# EasyEDA Pro project ProDoc_Crumb_V1_2026-06-22.epro

# Schematic Crumb_V1
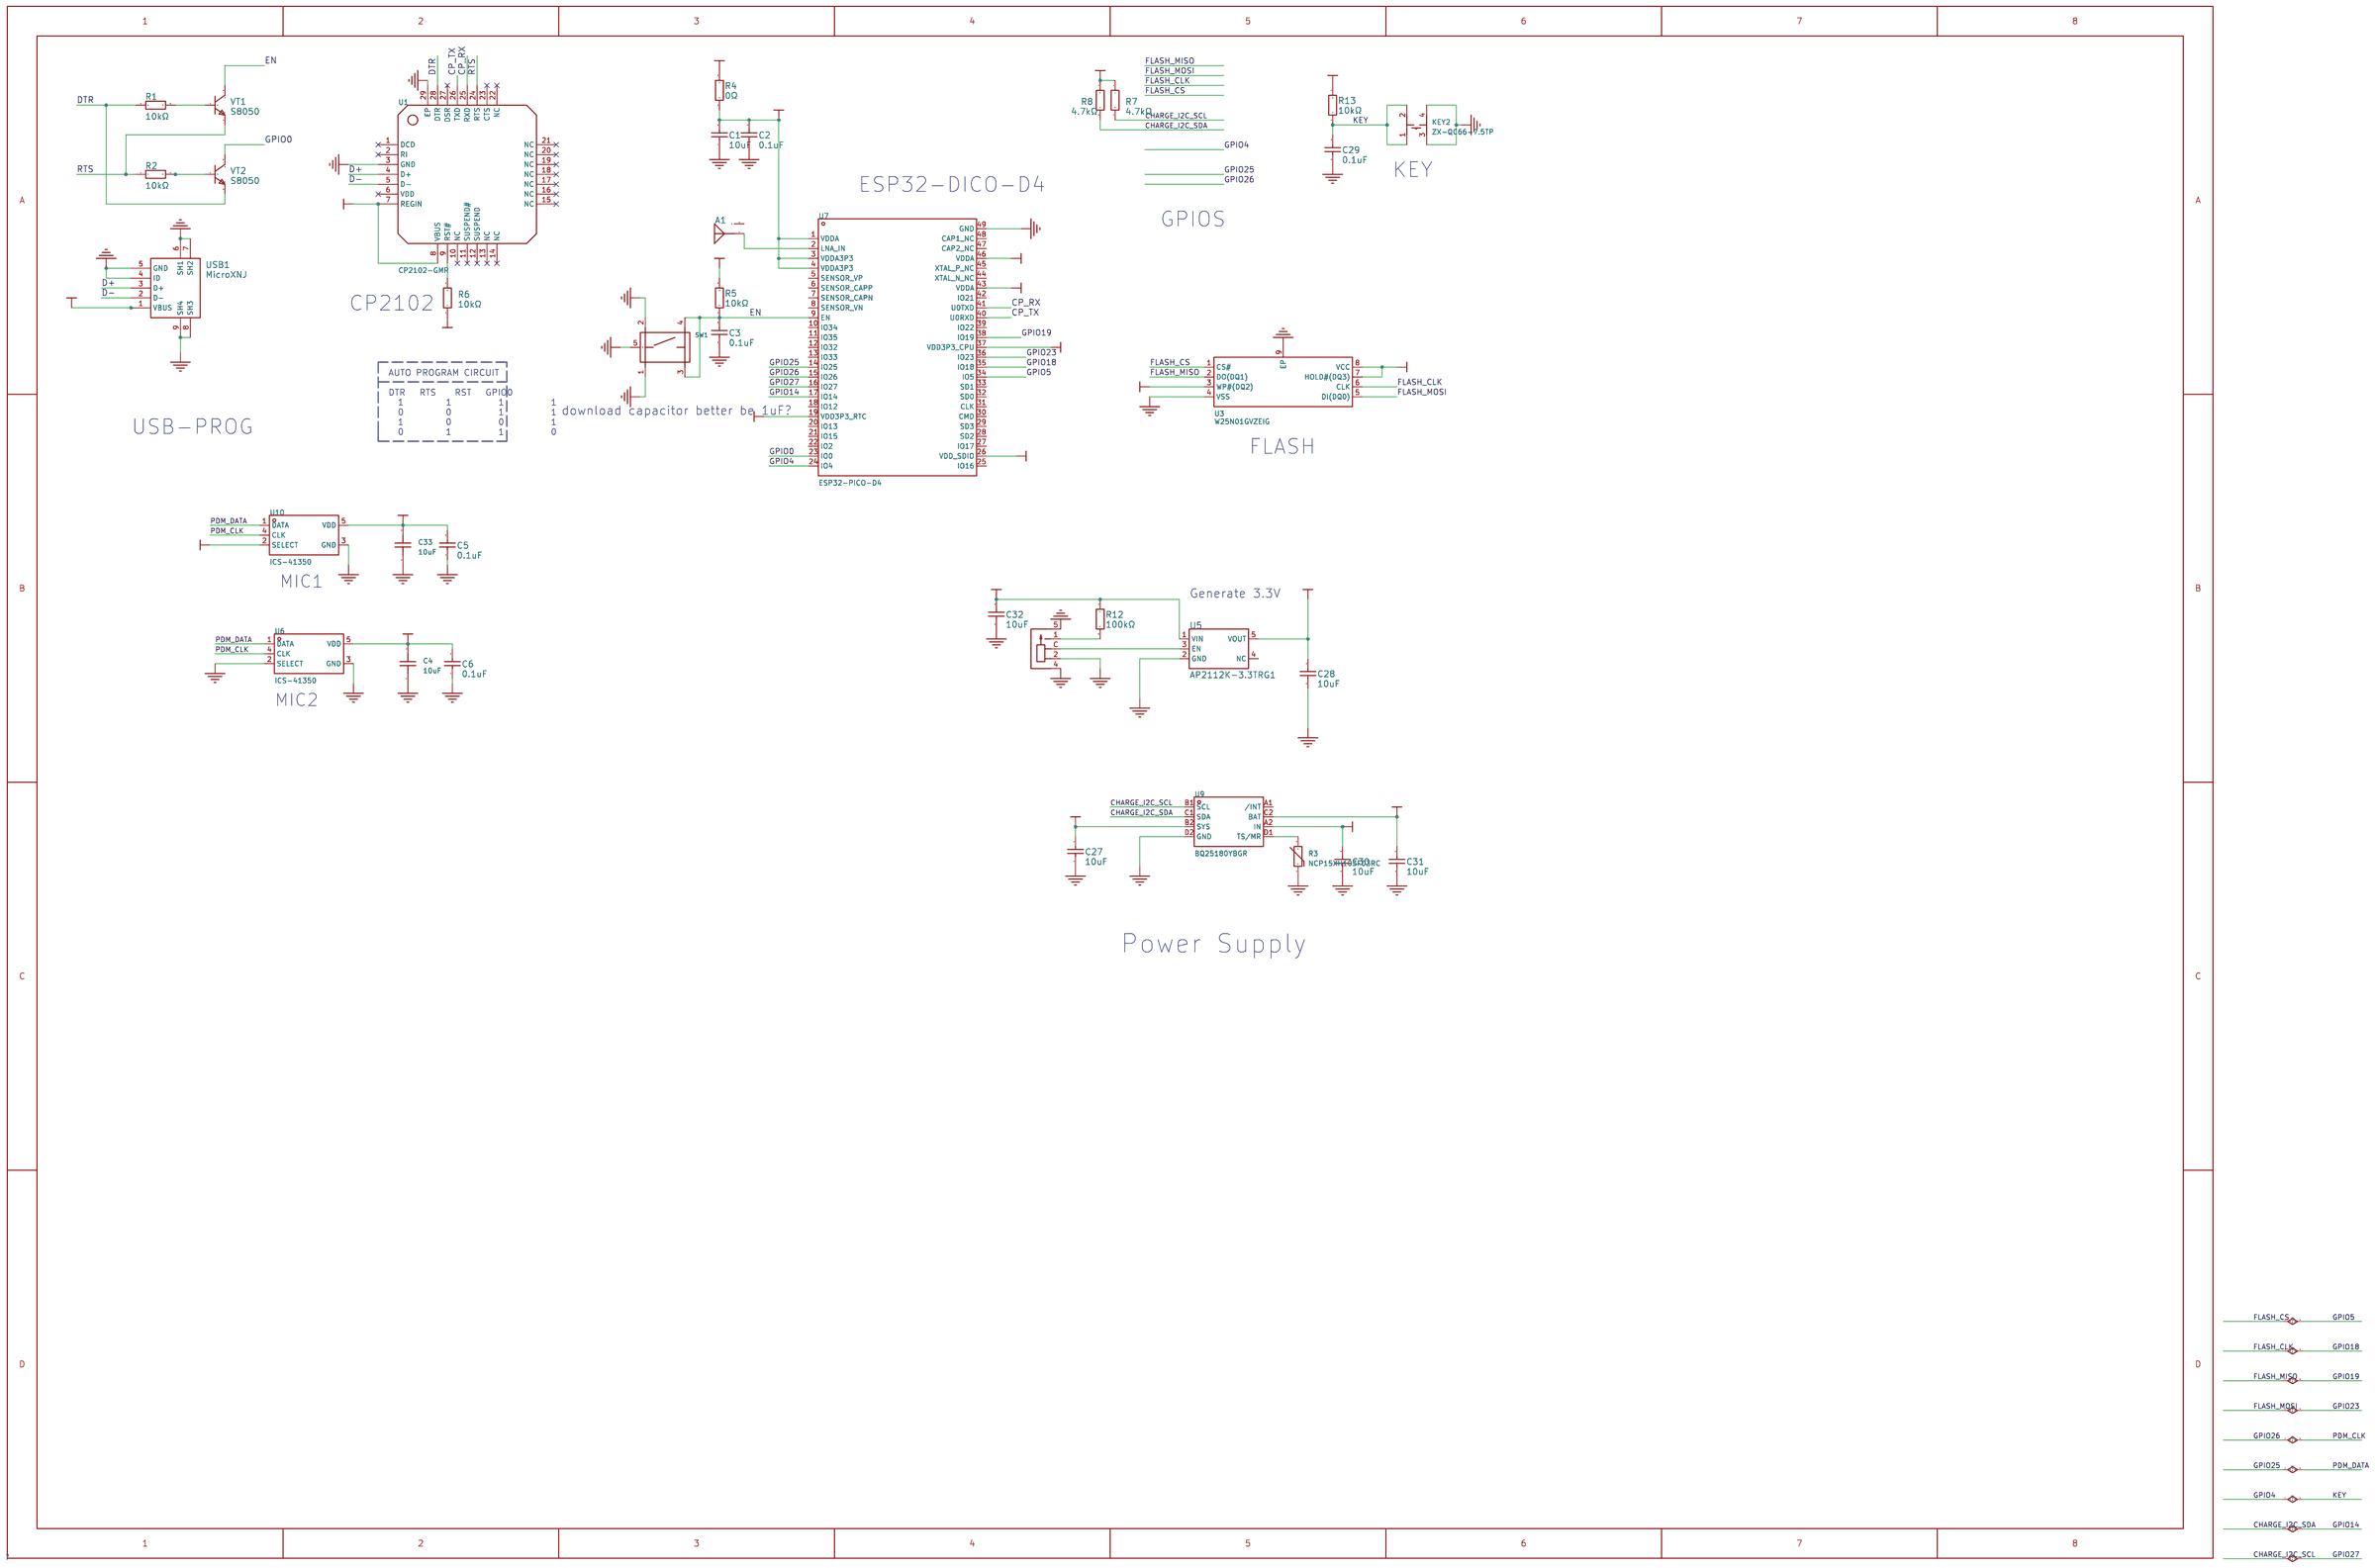
[diagram p0: schematic sheet]

## Parts
A1  AN2051-245  [ANT2051]
C1  10uF  [C0402]
C2  0.1uF  [C0402]
C3  0.1uF  [C0402]
C4  10uF  [C0402_1]
C5  0.1uF  [C0402]
C6  0.1uF  [C0402]
C27  10uF  [C0402]
C28  10uF  [C0402]
C29  0.1uF  [C0402]
C30  10uF  [C0402]
C31  10uF  [C0402]
C32  10uF  [C0402]
C33  10uF  [C0402_1]
KEY2  ZX-QC66-7.5TP  [KEY-SMD_4P-L6.0-W6.0-P4.50-LS8.6]
R1  10kΩ  [R0402]
R2  10kΩ  [R0402]
R3  NCP15XH103F03RC  [R0402]
R4  0Ω  [R0402]
R5  10kΩ  [R0402]
R6  10kΩ  [R0402]
R7  4.7kΩ  [R0402]
R8  4.7kΩ  [R0402]
R12  100kΩ  [R0402]
R13  10kΩ  [R0402]
SW1  KMR231GLFS  [KEY-SMD_KMR2XXGXXX]
SW?1  MK-11C04-G013  [SW-SMD_MK-11C04-G013]
U1  CP2102-GMR  [WQFN-28_L5.0-W5.0-P0.50-BL-EP3.2]
U3  W25N01GVZEIG  [WSON-8_L8.0-W6.10-P1.27-BL-EP]
U5  AP2112K-3.3TRG1  [SOT-23-5_L2.9-W1.6-P0.95-LS2.8-BR]
U6  ICS-41350  [MIC-SMD_5P-L3.5-W2.7-TL]
U7  ESP32-PICO-D4  [LGA-48_L7.0-W7.0-P0.50-BL-EP5.4]
U9  BQ25180YBGR  [DSBGA-8_L1.6-W0.9-R2-C4-P0.40-BL]
U10  ICS-41350  [MIC-SMD_5P-L3.5-W2.7-TL]
USB1  MicroXNJ  [MICRO-USB-SMD_MICROXNJ_1]
VT1  S8050  [SOT-23-3_L2.9-W1.3-P1.90-LS2.3-BR]
VT2  S8050  [SOT-23-3_L2.9-W1.3-P1.90-LS2.3-BR]

## Library data of the parts
A1 = AN2051-245: 中心频率:2.45GHz;带宽:110MHz;增益:0.5dBi;驻波比:2;; Supplier Part: C99727; Manufacturer: Rainsun(霖昱微); Supplier Footprint: SMD,5.1x2mm; JLCPCB Part Class: Extended Part; Datasheet: https://item.szlcsc.com/datasheet/AN2051-245/100941.html; Supplier: LCSC; Frequency(Center/Band): 2.45GHz; Bandwidth: 110MHz; Peak Gain: 0.5dBi; Impedance: 50Ω; VSWR: 2; Length: 5.1mm; Width: 2mm; Height: 1.2mm
C1 C27 C28 C30-C32 = 10uF: capacitance; LibraryName: Final_PCB
C2 C3 C5 C6 C29 = 0.1uF: capacitance; LibraryName: Final_PCB
C4 C33 = CL05A105KA5NQNC: 容值:1uF;精度:±10%;额定电压:25V;材质(温度系数):X5R;; LCSC Part Name: 1uF ±10% 25V; Supplier Part: C52923; Manufacturer: SAMSUNG(三星); Supplier Footprint: 0402; JLCPCB Part Class: Basic Part; Datasheet: https://atta.szlcsc.com/upload/public/pdf/source/20160218/1457707763339.pdf; Supplier: LCSC; Tolerance: ±10%; Voltage Rated: 25V; Temperature Coefficient: X5R; Check: true
KEY2 = ZX-QC66-7.5TP: 电路结构:单刀单掷;按钮形状:圆形按钮;作用力:2.6N;安装方式:立贴;开关长度:6mm;开关宽度:6mm;开关高度:7.5mm;带支架:不带支架;触点电流:50mA;额定电压:12V;工作寿命:10万次;; LCSC Part Name: 6*6*7.5贴片; Supplier Part: C7470157; Manufacturer: Megastar(兆星); Supplier Footprint: SMD-4P,6x6mm; JLCPCB Part Class: Extended Part; Datasheet: https://item.szlcsc.com/datasheet/ZX-QC66-7.5TP/8519163.html; Supplier: LCSC; Circuit: 单刀单掷; Actuator Style: 圆形按钮; Operating Force: 2.6N; Mounting Type: 立贴; Length: 6mm; Width: 6mm; Switch Height: 7.5mm; with Bracket: 不带支架; Contact Current: 50mA; Voltage Rating: 12V; Actuator/Cap Color: 黑色; Termination Style: 鸥翼型; Life: 10万次; Operating Temperature: -30℃~+80℃
R1 R2 R5 R6 R13 = 10kΩ: 贴片电阻; BOM名称: 贴片电阻; 联系卖家，免费查找封装: 唯一出售店铺网址https://shop463601444.taobao.com; 封装库来自淘宝卖家ID：黄晶宝石: 其他店铺购入均为盗版假冒封装库，请立即申请退款; LibraryName: Final_PCB
R3 = NCP15XH103F03RC: 阻值:10kΩ;B值(25℃/50℃):3380K;电阻精度:±1%;功率:100mW;B值精度:±1%;最大稳态电流(25℃):310uA;; LCSC Part Name: 10kΩ 3380K 100mW; Supplier Part: C77131; Manufacturer: muRata(村田); Supplier Footprint: 0402; JLCPCB Part Class: Extended Part; Datasheet: https://item.szlcsc.com/datasheet/NCP15XH103F03RC/78258.html; Supplier: LCSC; Resistance @ 25℃: 10kΩ; B Constant (25℃/50℃): 3380K; Resistance Tolerance: ±1%; B Constant (25℃/85℃): 3434K; B Constant (25℃/100℃): 3455K; Power(Watts): 100mW; B Constant Tolerance: ±1%; Steady State Current (Max): 310uA; Operating Temperature: -40℃~+125℃; Dissipation Factor: 1mW/℃; Length: 1mm; Width: 0.5mm
R4 = 0Ω: 贴片电阻; BOM名称: 贴片电阻; 联系卖家，免费查找封装: 唯一出售店铺网址https://shop463601444.taobao.com; 封装库来自淘宝卖家ID：黄晶宝石: 其他店铺购入均为盗版假冒封装库，请立即申请退款; LibraryName: Final_PCB
R7 R8 = RC0402FR-074K7L: 电阻类型:厚膜电阻;阻值:4.7kΩ;精度:±1%;功率:62.5mW;工作电压:50V;温度系数:±100ppm/℃;; LCSC Part Name: 厚膜电阻 4.7kΩ ±1% 62.5mW; Supplier Part: C105871; Manufacturer: YAGEO(国巨); Supplier Footprint: 0402; JLCPCB Part Class: Extended Part; Datasheet: https://item.szlcsc.com/datasheet/RC0402FR-074K7L/107086.html; Supplier: LCSC; Type: 厚膜电阻; Tolerance: ±1%; Power(Watts): 62.5mW; Voltage-Supply(Max): 50V; Temperature Coefficient: ±100ppm/℃; Operating Temperature: -55℃~+155℃
R12 = 100kΩ: 贴片电阻; BOM名称: 贴片电阻; 联系卖家，免费查找封装: 唯一出售店铺网址https://shop463601444.taobao.com; 封装库来自淘宝卖家ID：黄晶宝石: 其他店铺购入均为盗版假冒封装库，请立即申请退款; LibraryName: Final_PCB
SW1 = KMR231GLFS: 电路结构:单刀单掷;按钮形状:圆形按钮;作用力:3N;安装方式:立贴;开关长度:4.6mm;开关宽度:2.8mm;开关高度:1.9mm;触点电流:50mA;额定电压:32V;带灯:-;工作寿命:-;; LCSC Part Name: 4.6*2.8*1.9mm 立贴 轻触开关; Supplier Part: C99271; Manufacturer: C&K; Supplier Footprint: SMD,2.8x4.6mm; JLCPCB Part Class: Extended Part; Datasheet: https://item.szlcsc.com/datasheet/KMR231GLFS/100484.html; Supplier: LCSC; Circuit: 单刀单掷; Actuator Style: 圆形按钮; Operating Force: 3N; Mounting Type: 立贴; Length: 4.6mm; Width: 2.8mm; Switch Height: 1.9mm; Contact Current: 50mA; Voltage Rating: 32V; Termination Style: 鸥翼型; Operating Temperature: -40℃~+85℃
SW?1 = MK-11C04-G013: 电路结构:单刀双掷;安装方式:卧贴;开关颜色:黑色;额定电流:1A;额定电压:6V;工作寿命:1万次;; LCSC Part Name: 1P2T超小型拨动开关; Supplier Part: C778185; Manufacturer: G-Switch(品赞); Supplier Footprint: SMD,5.5x0.7mm; JLCPCB Part Class: Extended Part; Datasheet: https://item.szlcsc.com/datasheet/MK-11C04-G013/826786.html; Supplier: LCSC; Circuit: 单刀双掷; Actuator Style: 矩形柱状; Termination Style: J型引脚; Length: 5.5mm; Width: 0.7mm; Switch Height: 3.8mm; Mounting Type: 卧贴; Actuator Color: 黑色; Current Rating: 1A; Voltage Rating: 6V; Life: 1万次; Operating Temperature: -20℃~+70℃
U1 = CP2102-GMR: 应用功能:收发器;USB协议版本:USB 2.0;通道数:-;数据速率:1Mbps;; LCSC Part Name: 单芯片USB转UART桥接器; Supplier Part: C6568; Manufacturer: SKYWORKS/SILICON LABS(芯科); Supplier Footprint: WQFN-28-EP(5x5); JLCPCB Part Class: Extended Part; Datasheet: https://item.szlcsc.com/datasheet/CP2102-GMR/7033.html; Supplier: LCSC; Applications Function: 收发器; USB Protocol: USB 2.0; Voltage - Supply: 3V~3.6V; Data Rate: 1Mbps; Operating Temperature: -40℃~+85℃; Current - Supply: 20mA; Supply Current (Iq): 80uA
U3 = W25N01GVZEIG: 存储容量:1Gbit;时钟频率(fc):104MHz;工作电压:2.7V~3.6V;; LCSC Part Name: 具备双/四路SPI缓冲读取和连续读取功能的3V、1Gb串行SLCNAND闪存; Supplier Part: C907680; Manufacturer: Winbond(华邦); Supplier Footprint: WSON-8-EP(6.1x8); JLCPCB Part Class: Extended Part; Datasheet: https://item.szlcsc.com/datasheet/W25N01GVZEIG/973560.html; Supplier: LCSC; Memory Size: 1Gbit; Interface: SPI; Clock Frequency: 104MHz; Voltage - Supply: 2.7V~3.6V; Page Program time (TPP): 250us; Block Erase Time(tBE): 2ms; Data Retention - TDR (Year): 10年; Operating Temperature: -40℃~+85℃
U5 = AP2112K-3.3TRG1_C23380830: 输出类型:固定;工作电压:5.5V;输出电压:3.3V;输出电流:600mA;电源纹波抑制比(PSRR):75dB@(1kHz);输出极性:正极;; LCSC Part Name: 3.3V 600mA 5.5V; Supplier Part: C23380830; Manufacturer: TECH PUBLIC(台舟); Supplier Footprint: SOT-23-5; JLCPCB Part Class: Extended Part; Datasheet: https://item.szlcsc.com/datasheet/AP2112K-3.3TRG1/25111500.html; Supplier: LCSC; Output Type: 固定; Voltage - Supply: 5.5V; Output Voltage: 3.3V; Output Current: 600mA; Power Supply Rejection Ratio (PSRR): 75dB@(1kHz); Voltage Dropout: 320mV@(600mA); standby current: 10uA; Features: 过热保护; Operating Temperature: -40℃~+85℃@(Ta); Output Configuration: 正极; Number of Outputs: 1
U6 U10 = ICS-41350: 指向性:全指向;信噪比:64dB;灵敏度:-32dB;阻抗:-;; LCSC Part Name: 1.65V~3.63V32dB; Supplier Part: C3171856; Manufacturer: TDK InvenSense(应美盛); JLCPCB Part Class: Extended Part; Datasheet: https://item.szlcsc.com/datasheet/ICS-41350/3733793.html; Supplier: LCSC; Direction: 全指向; Voltage - Supply: 1.65V~3.63V; Current Consumption: 750uA; S/N Ratio: 64dB; Sensitivity: -32dB; Length: 3.5mm; Width: 2.65mm; Height: 0.98mm; Operating Temperature: -40℃~+85℃
U7 = ESP32-PICO-D4: 频率范围:2.412GHz~2.484GHz;接口:I2C,SPI;应用领域:IoT；WiFi；蓝牙;数据速率:150Mbps;灵敏度:-97dBm;典型应用频率:2.4GHz;; LCSC Part Name: 集成2.4GHz WIFI和蓝牙的模组; Supplier Part: C193707; Manufacturer: ESPRESSIF(乐鑫); Supplier Footprint: QFN-48-EP(7x7); JLCPCB Part Class: Extended Part; Datasheet: https://atta.szlcsc.com/upload/public/pdf/source/20241030/D827B2F779C1E113D6FAEAB430963FEE.pdf; Supplier: LCSC; Frequency Range: 2.412GHz~2.484GHz; Interface: I2C,SPI; Operating Voltage: 2.7V~3.6V; Applications: IoT；WiFi；蓝牙; Output Power: 20dBm; Data Rate: 150Mbps; Sensitivity: -97dBm; Receive Current: 30mA; Typical Application Frequency: 2.4GHz; Operating Temperature: -40℃~+85℃
U9 = BQ25180YBGR: 工作电压:5.5V;最大充电电流:1A;电池类型:锂离子/聚合物;电池节数:1;; Supplier Part: C3682423; Manufacturer: TI(德州仪器); Supplier Footprint: DSBGA-8(1.1x1.6); JLCPCB Part Class: Extended Part; Datasheet: https://www.ti.com/cn/lit/gpn/bq25180; Supplier: LCSC; Voltage - Supply: 5.5V; Charge Current - Max: 1A; Type of Battery: 锂离子/聚合物; Number of Cells: 1; Operating Temperature: -40℃~+125℃
USB1 = MicroXNJ: 连接器类型:Micro-B;协议标准:USB 2.0;公母:母;安装方式:卧贴;触点数量:5P;端口数量:1;额定电流 - 电源:1.8A;工作温度:-20℃~+85℃;; LCSC Part Name: Micro小牛角卧贴母座; Supplier Part: C404969; Manufacturer: SHOU HAN(首韩); Supplier Footprint: SMD; JLCPCB Part Class: Extended Part; Datasheet: https://item.szlcsc.com/datasheet/MicroXNJ/392534.html; Supplier: LCSC; Connector Type: Micro-B; Protocol Standard: USB 2.0; Gender: 母; Mounting Type: 卧贴; Number of Contacts: 5P; Number of Ports: 1; Current Rating-Power: 1.8A; Voltage Rating: 30V; Connect-Disconnect Life: 5千次; Detection color: 黑色; Operating Temperature: -20℃~+85℃
VT1 VT2 = S8050_C20069125: 晶体管类型:NPN;集电极电流(Ic):500mA;集射极击穿电压(Vceo):25V;耗散功率(Pd):300mW;直流电流增益(hFE):120@50mA,1.0V;; LCSC Part Name: hFE:200-350，丝印:J3Y NPN 500mA 25V; Supplier Part: C20069125; Manufacturer: R+O(宏嘉诚); Supplier Footprint: SOT-23; JLCPCB Part Class: Extended Part; Datasheet: https://item.szlcsc.com/datasheet/S8050/21397163.html; Supplier: LCSC; type: NPN; Current - Collector(Ic): 500mA; Collector - Emitter Voltage VCEO: 25V; Pd - Power Dissipation: 300mW; DC Current Gain: 120@50mA,1.0V; Transition frequency(fT): 100MHz; Current - Collector Cutoff: 100nA; Vce Saturation(VCE(sat)): 600mV@500mA,50mA; Operating Temperature: -55℃~+150℃; Emitter-Base Voltage(Vebo): 5V

## Nets
3V3: C4.2 C5.2 C6.2 C28.1 C33.2 R4.2 R5.2 R7.1 R8.1 R13.2 U3.3(WP#(DQ2)) U3.7(HOLD#(DQ3)) U3.8(VCC) U5.5(VOUT) U6.5(VDD) U10.2(SELECT) U10.5(VDD)
3V3A: C1.2 C2.2 R4.1 U7.1(VDDA) U7.3(VDDA3P3) U7.4(VDDA3P3) U7.19(VDD3P3_RTC) U7.26(VDD_SDIO) U7.37(VDD3P3_CPU) U7.43(VDDA) U7.46(VDDA)
GND: C1.1 C2.1 C3.1 C4.1 C5.1 C6.1 C27.2 C28.2 C29.1 C30.2 C31.2 C32.2 C33.1 KEY2.3 KEY2.4 R3.1 SW1.1 SW1.2 SW1.5 SW?1.2 SW?1.4 SW?1.5 U1.3(GND) U1.29(EP) U3.4(VSS) U3.9(EP) U5.2(GND) U6.2(SELECT) U6.3(GND) U7.49(GND) U9.D2(GND) U10.3(GND) USB1.4(ID) USB1.5(GND) USB1.6(SH1) USB1.7(SH2) USB1.8(SH3) USB1.9(SH4)
VBAT: C31.1 U9.C2(BAT)
VDD_5V: C30.1 R6.1 U1.7(REGIN) U1.8(VBUS) U9.A2(IN) USB1.1(VBUS)
CHARGE_I2C_SCL: R7.2 U7.16(IO27) U9.B1(SCL)
CHARGE_I2C_SDA: R8.2 U7.17(IO14) U9.C1(SDA)
CP_RX: U1.25(RXD) U7.41(U0TXD)
CP_TX: U1.26(TXD) U7.40(U0RXD)
D+: U1.4(D+) USB1.3(D+)
D-: U1.5(D-) USB1.2(D-)
DTR: R1.1 U1.28(DTR) VT2.2(E)
EN: C3.2 R5.1 SW1.3 SW1.4 U7.9(EN) VT1.3(C)
FLASH_CLK: U3.6(CLK) U7.35(IO18)
FLASH_CS: U3.1(CS#) U7.34(IO5)
FLASH_MISO: U3.2(DO(DQ1)) U7.38(IO19)
FLASH_MOSI: U3.5(DI(DQ0)) U7.36(IO23)
GPIO0: U7.23(IO0) VT2.3(C)
GPIO4: C29.2 KEY2.1 KEY2.2 R13.1 U7.24(IO4)
GPIO25: U6.1(DATA) U7.14(IO25) U10.1(DATA)
GPIO26: U6.4(CLK) U7.15(IO26) U10.4(CLK)
RTS: R2.1 U1.24(RTS) VT1.2(E)
VSYS: C27.1 C32.1 R12.1 U5.1(VIN) U9.B2(SYS)
$1N153: R1.2 VT1.1(B)
$1N154: R2.2 VT2.1(B)
$1N181: R6.2 U1.9(RST#)
$1N233: A1.1(ANT) U7.2(LNA_IN)
$1N287: SW?1.C U5.3(EN)
$1N288: R12.2 SW?1.1
$1N315: R3.2 U9.D1(TS/MR)

Not connected (* = marked no-connect by the designer): A1 2; U1 1(DCD)* 2(RI)* 6(VDD)* 10(NC)* 11(SUSPEND#)* 12(SUSPEND)* 13(NC)* 14(NC)* 15(NC)* 16(NC)* 17(NC)* 18(NC)* 19(NC)* 20(NC)* 21(NC)* 22(NC)* 23(CTS)* 27(DSR)*; U5 4(NC); U7 5(SENSOR_VP) 6(SENSOR_CAPP) 7(SENSOR_CAPN) 8(SENSOR_VN) 10(IO34) 11(IO35) 12(IO32) 13(IO33) 18(IO12) 20(IO13) 21(IO15) 22(IO2) 25(IO16) 27(IO17) 28(SD2) 29(SD3) 30(CMD) 31(CLK) 32(SD0) 33(SD1) 39(IO22) 42(IO21) 44(XTAL_N_NC) 45(XTAL_P_NC) 47(CAP2_NC) 48(CAP1_NC); U9 A1(/INT)

## Notes on the sheet
- KEY
- ESP32-DICO-D4
- GPIOS
- CP2102
- AUTO PROGRAM CIRCUIT
  DTR   RTS    RST   GPIO0
    1         1          1          1
    0         0          1          1
    1         0          0          1
    0         1          1          0
- download capacitor better be 1uF?
- USB-PROG
- FLASH
- MIC1
- Generate 3.3V
- MIC2
- Power Supply

# Board PCB1
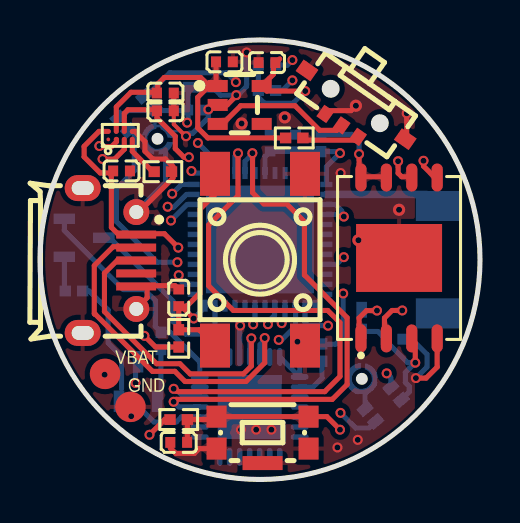
[diagram p1: board, top side]
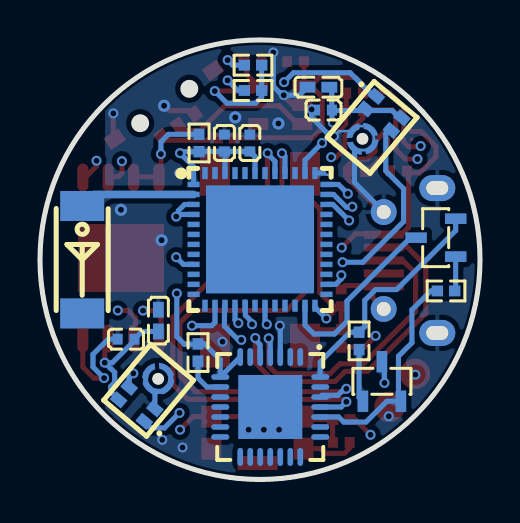
[diagram p2: board, bottom side, seen from below]

Outline 22 x 22 mm; copper layers: Top Layer, Inner1, Inner2, Bottom Layer. Coordinates in mm from the lower left corner of the outline.
Outline path: circle c11,11 r11
Stack: Top Layer 0.035mm Outer layer thickness 1oz / Dielectric1 0.2104mm 7628 RC49% 8.6mil / Inner1 0.0152mm Inner layer thickness / Dielectric2 1.065mm 1.1mm H/HOZ Copper / Inner2 0.0152mm Inner layer thickness / Dielectric3 0.2104mm 7628 RC49% 8.6mil / Bottom Layer 0.035mm Outer layer thickness 1oz

## Design rules (mm)
spacing copperThickness1oz (default): track to track 0.102, other pairs 0.152 to 0.3
spacing copperThickness2oz: track to track 0.203, other pairs 0.152 to 0.3
track width copperThickness1oz (default): min 0.127, default 0.254, max 2.54
track width copperThickness2oz: min 0.203, default 0.254, max 2.54
differential pair differentialPair (default): width min 0.127, default 0.254, max 2.54; gap min 0.152, default 0.152
net 3V3A uses copperRegion
net GND uses copperRegion
net 3V3 uses copperRegion

## Placement (name value [footprint] x y rotation side)
A1  AN2051-245  [ANT2051]  19.89 11 270 bottom
C1  10uF  [C0402]  11.51 16.84 270 bottom
C2  0.1uF  [C0402]  12.78 16.84 270 bottom
C3  0.1uF  [C0402]  6.94 1.86 0 top
C4  10uF  [C0402_1]  16.08 7.95 270 bottom
C5  0.1uF  [C0402]  7.82 18.49 180 bottom
C6  0.1uF  [C0402]  17.7 7.02 180 bottom
C27  10uF  [C0402]  6.27 19.34 0 top
C28  10uF  [C0402]  11.35 20.87 180 top
C29  0.1uF  [C0402]  6.94 9.09 270 top
C30  10uF  [C0402]  4.08 15.44 0 top
C31  10uF  [C0402]  6.27 18.45 0 top
C32  10uF  [C0402]  9.22 20.91 0 top
C33  10uF  [C0402_1]  8.08 19.64 180 bottom
KEY2  ZX-QC66-7.5TP  [KEY-SMD_4P-L6.0-W6.0-P4.50-LS8.6]  11 11 90 top
NOREF  -  [Pad_e667]  4.52 3.63 0 top
NOREF#2  -  [Pad_e666]  3.25 5.28 0 top
R1  10kΩ  [R0402]  6.05 6.94 270 bottom
R2  10kΩ  [R0402]  1.7 9.44 180 bottom
R3  NCP15XH103F03RC  [R0402]  6.14 15.41 180 top
R4  0Ω  [R0402]  14.05 16.84 90 bottom
R5  10kΩ  [R0402]  6.94 3 180 top
R6  10kΩ  [R0402]  14.1 6.35 270 bottom
R7  4.7kΩ  [R0402]  11.35 19.47 0 bottom
R8  4.7kΩ  [R0402]  11.35 20.74 0 bottom
R12  100kΩ  [R0402]  12.71 17.1 0 top
R13  10kΩ  [R0402]  6.94 7.06 270 top
SW1  KMR231GLFS  [KEY-SMD_KMR2XXGXXX]  11.13 1.98 180 top
SW?1  MK-11C04-G013  [SW-SMD_MK-11C04-G013]  15.44 18.24 145 top
U1  CP2102-GMR  [WQFN-28_L5.0-W5.0-P0.50-BL-EP3.2]  10.49 3.63 0 bottom
U3  W25N01GVZEIG  [WSON-8_L8.0-W6.10-P1.27-BL-EP]  17.95 11.09 0 top
U5  AP2112K-3.3TRG1  [SOT-23-5_L2.9-W1.6-P0.95-LS2.8-BR]  9.98 18.75 180 top
U6  ICS-41350  [MIC-SMD_5P-L3.5-W2.7-TL]  16.56 4.48 40 bottom
U7  ESP32-PICO-D4  [LGA-48_L7.0-W7.0-P0.50-BL-EP5.4]  11 12.02 270 bottom
U9  BQ25180YBGR  [DSBGA-8_L1.6-W0.9-R2-C4-P0.40-BL]  4.01 17.22 0 top
U10  ICS-41350  [MIC-SMD_5P-L3.5-W2.7-TL]  5.41 17.6 220 bottom
USB1  MicroXNJ  [MICRO-USB-SMD_MICROXNJ_1]  3.48 10.96 270 top
VT1  S8050  [SOT-23-3_L2.9-W1.3-P1.90-LS2.3-BR]  4.9 4.9 270 bottom
VT2  S8050  [SOT-23-3_L2.9-W1.3-P1.90-LS2.3-BR]  2.21 12.1 180 bottom

## Footprints (pads in the part's own frame, mm; a bottom-side part is the same pattern mirrored in y, then rotated)
ANT2051
  rect 1.5x2.2 smd: 1(-2.69,0) 2(2.69,0)
C0402
  rect 0.5x0.54 smd: 1(-0.42,0) 2(0.42,0)
C0402_1
  rect 0.79x0.54 smd: 1(-0.545,0) 2(0.545,0)
DSBGA-8_L1.6-W0.9-R2-C4-P0.40-BL
  round 0.184 smd: A1(-0.6,-0.2) A2(-0.6,0.2) B1(-0.2,-0.2) B2(-0.2,0.2) C1(0.2,-0.2) C2(0.2,0.2) D1(0.6,-0.2) D2(0.6,0.2)
KEY-SMD_4P-L6.0-W6.0-P4.50-LS8.6
  rect 2.2x1.5 smd: 1(-4.3,2.25) 2(4.3,2.25) 3(-4.3,-2.25) 4(4.3,-2.25)
KEY-SMD_KMR2XXGXXX
  rect 1x1.1 smd: 1(-2.3,0.438) 2(2.3,0.438) 3(-2.3,-1.162) 4(2.3,-1.162)
  rect 2x0.7 smd: 5(0,1.162)
LGA-48_L7.0-W7.0-P0.50-BL-EP5.4
  rect 0.27x0.6 smd: 1(-2.75,-3.32) 2(-2.25,-3.32) 3(-1.75,-3.32) 4(-1.25,-3.32) 5(-0.75,-3.32) 6(-0.25,-3.32) 7(0.25,-3.32) 8(0.75,-3.32) 9(1.25,-3.32) 10(1.75,-3.32) 11(2.25,-3.32) 12(2.75,-3.32) 25(2.75,3.32) 26(2.25,3.32) 27(1.75,3.32) 28(1.25,3.32) 29(0.75,3.32) 30(0.25,3.32) 31(-0.25,3.32) 32(-0.75,3.32) 33(-1.25,3.32) 34(-1.75,3.32) 35(-2.25,3.32) 36(-2.75,3.32)
  rect 0.6x0.27 smd: 13(3.32,-2.75) 14(3.32,-2.25) 15(3.32,-1.75) 16(3.32,-1.25) 17(3.32,-0.75) 18(3.32,-0.25) 19(3.32,0.25) 20(3.32,0.75) 21(3.32,1.25) 22(3.32,1.75) 23(3.32,2.25) 24(3.32,2.75) 37(-3.32,2.75) 38(-3.32,2.25) 39(-3.32,1.75) 40(-3.32,1.25) 41(-3.32,0.75) 42(-3.32,0.25) 43(-3.32,-0.25) 44(-3.32,-0.75) 45(-3.32,-1.25) 46(-3.32,-1.75) 47(-3.32,-2.25) 48(-3.32,-2.75)
  rect 5.4x5.4 smd: 49(0,0)
MIC-SMD_5P-L3.5-W2.7-TL
  rect 0.725x0.522 smd: 1(-0.838,1.351) 2(-0.838,0.529) 4(0.838,0.529) 5(0.838,1.351)
  custom 0.38x0.974 smd: 3(-0.629,-0.728) 3(0.629,-0.717)
  custom 0.974x0.381 smd: 3(-0.005,-0.093) 3(0.005,-1.351)
MICRO-USB-SMD_MICROXNJ_1
  rect 0.4x2 smd: 1(-1.3,1.332) 2(-0.65,1.332) 3(0,1.332) 4(0.65,1.332) 5(1.3,1.332)
  round 1.3 hole 0.7: 6(2.425,1.34) 9(-2.425,1.34)
  oval 1.3x1.8 hole 0.7x1.1: 7(3.625,-1.34) 8(-3.625,-1.34)
Pad_e666
  round 1.524 smd: 2(0,0)
Pad_e667
  round 1.524 smd: 1(0,0)
R0402
  rect 0.566x0.54 smd: 1(-0.433,0) 2(0.433,0)
SOT-23-3_L2.9-W1.3-P1.90-LS2.3-BR
  rect 1.07x0.532 smd: 1(0.99,-0.95) 2(0.99,0.95) 3(-0.99,0)
SOT-23-5_L2.9-W1.6-P0.95-LS2.8-BR
  rect 1x0.6 smd: 1(1.1,-0.95) 2(1.1,0) 3(1.1,0.95) 4(-1.1,0.95) 5(-1.1,-0.95)
SW-SMD_MK-11C04-G013
  rect 0.6x0.7 smd: 1(-1,0.63) 2(1,0.63) C(0,0.63)
  rect 0.9x0.7 smd: 4(3,-0.63) 5(-3,-0.63)
WQFN-28_L5.0-W5.0-P0.50-BL-EP3.2
  oval 0.28x0.9 smd: 1(-1.502,-2.5) 2(-1.001,-2.5) 3(-0.5,-2.5) 4(0,-2.5) 5(0.5,-2.5) 6(1,-2.5) 7(1.501,-2.5) 15(1.501,2.5) 16(1,2.5) 17(0.5,2.5) 18(0,2.5) 19(-0.5,2.5) 20(-1.001,2.5) 21(-1.502,2.5)
  oval 0.9x0.28 smd: 8(2.5,-1.502) 9(2.5,-1.001) 10(2.5,-0.5) 11(2.5,0) 12(2.5,0.5) 13(2.5,1) 14(2.5,1.501) 22(-2.5,1.501) 23(-2.5,1) 24(-2.5,0.5) 25(-2.5,0) 26(-2.5,-0.5) 27(-2.5,-1.001) 28(-2.5,-1.502)
  rect 3.2x3.2 smd: 29(0,0)
WSON-8_L8.0-W6.10-P1.27-BL-EP
  oval 0.56x1.4 smd: 1(-1.905,-4.027) 2(-0.635,-4.027) 3(0.635,-4.027) 4(1.905,-4.027) 5(1.905,4.027) 6(0.635,4.027) 7(-0.635,4.027) 8(-1.905,4.027)
  rect 4.3x3.4 smd: 9(0,0)

## Nets
As in the schematic, except:
GND: C1.1 C2.1 C3.1 C4.1 C5.1 C6.1 C27.2 C28.2 C29.1 C30.2 C31.2 C32.2 C33.1 KEY2.3 KEY2.4 NOREF.1 R3.1 SW1.1 SW1.2 SW1.5 SW?1.2 SW?1.4 SW?1.5 U1.3 U1.29 U3.4 U3.9 U5.2 U6.2 U6.3 U7.49 U9.D2 U10.3 USB1.4 USB1.5 USB1.6 USB1.7 USB1.8 USB1.9
VBAT: C31.1 NOREF#2.2 U9.C2

Pads without a net: A1 2; U1 1 2 6 10 11 12 13 14 15 16 17 18 19 20 21 22 23 27; U5 4; U7 5 6 7 8 10 11 12 13 18 20 21 22 25 27 28 29 30 31 32 33 39 42 44 45 47 48; U9 A1

## Via types
v1: diameter 0.5, hole 0.3, Top Layer to Bottom Layer, 60 vias
v2: diameter 0.61, hole 0.305, Top Layer to Bottom Layer, 5 vias

## Routing (per net, layer and track width the routed paths; a pad name or vN(x,y) marks a point on that pad's centre or on a via; arc(x,y) is an arc through that point)
3V3: length 29.2
  Top Layer w0.254: v1(15.95,16.29) 15.95,15.16 ; v1(5.22,7.19) 5.78,6.63 R13.2 ; 17.22,15.15 15.95,15.15 ; 11.98,21.05 11.67,20.74 11.67,20.29 U5.5 11.34,19.44 v1(13.26,19.44) ; 6.5,3 6.24,3 v1(5.47,2.24) ; v1(18.76,5.85) 18.76,6.83 18.49,7.1
  Bottom Layer w0.254: v1(15.95,16.29) 15.95,16.9 15.58,17.27 R4.2 ; v1(7.36,17.86) 7.41,17.91 7.41,18.47 ; 7.41,18.47 7.41,18.47 7.41,19.51 C33.2 ; 7.41,18.47 4.39,18.47 4.03,18.1 ; 7.41,18.47 C5.2 ; v1(13.26,19.44) 12.65,18.83 11.22,18.83 10.92,19.14 R7.1 R8.1 ; C4.2 16.9,7.41 17.28,7.02 17.24,6.99 18.38,5.85 v1(18.76,5.85) 18.48,5.56 18.46,5.56 18.27,5.36 18.27,4.85 18.46,4.66 18.46,4.38 18.07,3.99
3V3A: length 12.4
  Bottom Layer w0.254: U7.1 14.32,15.66 v1(15,16.33) 14.92,16.41 R4.1 14.04,16.42 C2.2 ; C2.2 12.75,16.39 U7.46 ; C2.2 C1.2 11.25,16.16 U7.43 ; U7.3 14.77,13.77 15.08,13.45 15.08,13.27 ; U7.4 15.08,13.27 ; 15.08,13.27 v1(15.19,13.16) ; U7.19 10.75,7.85 v1(10.66,7.76) ; v1(7.57,15.44) 7.68,15.34 U7.37 ; U7.26 7.21,9.77 6.94,10.04 v1(6.94,10.22)
GND: length 47.6
  Top Layer w0.2: v1(7.3,17.18) 7.3,17.19 7.18,17.31 7.16,17.31 6.69,17.78 C31.2
  Top Layer w0.254: C3.1 6.52,1.58 6.78,1.31 7.72,1.31 7.96,1.55 SW1.2 ; U9.D2 4.74,17.42 5.25,16.91 5.25,16.43 5.63,16.04 6.27,16.04 6.65,15.66 6.65,15.09 4.98,13.42 4.83,13.42 ; v1(18.33,18.33) 18.33,17.1 SW?1.5 ; v1(18.79,5.07) 19.31,5.07 19.86,5.63 U3.4 ; 4.84,8.58 5.36,9.1 5.36,9.7 6.75,9.7 C29.1 ; SW?1.2 14.43,18.46 15.55,18.46 v2(15.79,18.71) ; U5.2 9.36,18.75 9.81,19.2 v1(9.81,19.24) ; C27.2 C31.2
  Inner1 w0.254: v1(12.87,6.9) 12.37,6.39 10.21,6.39 9.95,6.64 9.95,7.64 v1(10.01,7.7)
  Bottom Layer w0.127: v1(7.3,17.18) 7.04,17.44 6.38,17.44 6.28,17.54 6.19,17.54 6.03,17.69 5.72,17.69 5.56,17.54 U10.3 5.48,17.45 5.31,17.28 5.31,16.73 U10.3 5.48,16.65 5.64,16.49 6.2,16.49 6.28,16.57
  Bottom Layer w0.254: 6.28,16.57 6.28,14.87 4.83,13.42 ; U6.3 15.47,5.3 15.47,4.78 U6.3 15.83,4.41 16.35,4.41 ; v1(7.3,17.18) 7.45,17.33 7.63,17.33 8.42,18.11 v1(8.42,18.52) ; U1.3 9.99,7.68 v1(10.01,7.7) ; C6.1 18.59,7.02 19.35,6.26 19.35,5.63 v1(18.79,5.07) ; 16.35,4.41 U6.3 16.72,4.78 16.72,5.3 U6.3 ; 16.35,4.41 16.25,4.31 U6.2 ; C33.1 9.02,19.24 v1(9.81,19.24) 9.94,19.36 10.01,19.36 10.32,19.67 10.32,19.75 10.33,19.76 v1(10.33,21.37)
  vias: v1(4.56,3.16) v1(10.05,2.49) v1(10.81,2.49) v1(11.57,2.49) v1(14.87,1.6) v1(15.03,15.34) v1(15.89,1.98) v2(10.08,17.82) v2(12.24,18.12) v2(15.92,11.98) v2(17.95,13.5)
VBAT: length 19.6
  Top Layer w0.254: v1(7.44,16.13) 7.19,16.13 6.76,16.56 6.76,17.18 5.85,18.09 C31.1 5.8,18.51 4.39,18.51 4.22,18.33 U9.C2
  Inner1 w0.254: v1(3.23,5.24) 3.44,5.46 3.44,14.17 5.4,16.13 v1(7.44,16.13)
VDD_5V: length 33.9
  Top Layer w0.254: v1(6.91,11.61) 6.22,12.3 3.89,12.3 3.57,12.62 3.57,15.34 3.01,15.34 2.21,16.15 2.21,16.68 2.95,17.42 U9.A2
  Inner1 w0.254: v1(6.91,11.61) 6.73,11.61 6.22,11.09 6.22,7.71 8.05,5.88 13.64,5.88 15.16,7.4 v1(15.16,9.31)
  Bottom Layer w0.254: U1.7 U1.8 12.99,5.99 13.78,6.79 R6.1 14.12,6.77 14.78,6.77 15.16,7.15 v1(15.16,9.31)
CHARGE_I2C_SCL: length 30.1
  Top Layer w0.254: v1(2.97,16.69) 3.01,16.65 3.57,16.65 3.82,16.91 3.82,17.01 U9.B1
  Inner2 w0.254: v1(12.62,19.98) 12.18,20.42 8.87,20.42 7.79,19.34 5.62,19.34 v1(2.97,16.69) 3.52,16.69 3.82,16.39 3.82,11.89 6.62,9.09 11.17,9.09 12.08,8.18 v1(12.08,7.83)
  Bottom Layer w0.254: v1(12.62,19.98) 12.11,19.47 R7.2 ; v1(12.08,7.83) 12.25,7.99 U7.16
CHARGE_I2C_SDA: length 31.5
  Top Layer w0.254: v1(3.13,16.04) 3.73,16.04 4.22,16.53 U9.C1
  Inner2 w0.254: v1(11.4,7.77) 11.19,7.98 11.19,7.98 10.59,8.59 6.36,8.59 3.34,11.61 3.34,15.82 v1(3.13,16.04) 2.59,16.04 2.41,16.22 2.41,16.88 5.25,19.72 7.54,19.72 8.59,20.77 12.4,20.77 v1(12.62,20.99)
  Bottom Layer w0.254: R8.2 12.37,20.74 v1(12.62,20.99) ; 11.73,8.88 11.73,8.22 11.4,7.89 v1(11.4,7.77)
CP_RX: length 25.8
  Top Layer w0.254: v1(10.62,16.33) 10.63,16.32 10.63,14.35 11.19,13.79 12.33,13.79 13.22,12.91 13.22,10.23 15.35,8.1 15.35,4.75 14.61,4.01 6.81,4.01 v1(6.68,3.89)
  Bottom Layer w0.254: U7.41 10.25,15.93 10.62,16.3 v1(10.62,16.33) ; v1(6.68,3.89) 6.94,3.63 U1.25
CP_TX: length 28.5
  Top Layer w0.254: v1(6.68,4.54) 6.81,4.42 6.9,4.42 6.92,4.4 14.24,4.4 15,5.16 15,7.85 14.39,8.46 9.66,8.46 8.43,9.7 8.43,12.73 9.9,14.21 v1(9.9,16.33)
  Bottom Layer w0.254: 7.99,4.13 7.91,4.21 7.11,4.21 6.78,4.54 v1(6.68,4.54) ; U7.40 9.75,16.17 v1(9.9,16.33)
D+: length 15.5
  Top Layer w0.254: 5.36,11 3.9,11 3.22,10.33 3.22,8.4 5.83,5.79 7,5.79 7.51,5.28 10.17,5.28 10.57,5.68 v1(10.57,7.06)
  Bottom Layer w0.254: U1.4 10.49,6.98 v1(10.57,7.06)
D-: length 18.1
  Top Layer w0.254: 5.36,11.65 3.66,11.65 2.71,10.71 2.71,8.3 2.75,8.27 2.77,8.27 5.62,5.41 6.74,5.41 7.25,4.9 10.3,4.9 11.24,5.84 v1(11.24,7.08)
  Bottom Layer w0.254: v1(11.24,7.08) 11.24,6.99 11,6.75 11,6.14 U1.5
DTR: length 11.6
  Bottom Layer w0.254: U1.28 7.99,5.89 6.5,7.37 R1.1 5.76,7.65 5.76,8.96 5.22,9.5 4.17,9.5 1.22,12.46 1.22,13.05
EN: length 38.1
  Top Layer w0.254: v1(15,2.49) 14.34,3.14 SW1.4 8.68,3 R5.1 7.37,1.87 C3.2
  Inner2 w0.254: v1(15.19,11.13) 15.92,10.4 15.92,7.28 16.75,6.45 18.91,6.45 19.35,6.01 19.35,4.86 17,2.51 15.02,2.51 v1(15,2.49) 14.18,2.49 13.65,1.96 6.51,1.96 4.78,3.7 v1(4.78,4.83)
  Bottom Layer w0.254: v1(4.78,4.83) 4.78,5.77 VT1.3 ; v1(15.19,11.13) 14.83,10.77 U7.9
FLASH_CLK: length 15.7
  Top Layer w0.254: 18.49,15.15 18.08,15.15 17.91,15.33 v1(17.91,15.93)
  Inner2 w0.254: v1(17.91,15.93) 17.91,15.3 17.03,14.43 7.53,14.43 6.75,13.65 v1(6.38,13.65)
  Bottom Layer w0.254: U7.35 7.32,14.27 6.68,13.63 6.41,13.63 v1(6.38,13.65)
FLASH_CS: length 18.8
  Top Layer w0.254: 15.95,7.1 15.95,8.08 16.33,8.45 v1(16.85,8.45)
  Inner2 w0.254: v1(16.85,8.45) 16.85,8.52 16.56,8.81 16.56,13 15.76,13.79 7.4,13.79 6.56,12.96 v1(6.55,12.96)
  Bottom Layer w0.254: U7.34 7.35,13.77 v1(6.55,12.96)
FLASH_MISO: length 27.3
  Top Layer w0.254: 17.22,7.1 17.22,8.08 17.6,8.46 v1(18.11,8.46)
  Inner2 w0.254: v1(18.11,8.46) 19.19,8.46 20.21,9.48 20.21,15.95 19.2,16.96 16.15,16.96 14.4,18.71 9.5,18.71 7.9,17.1 v1(7.9,16.84)
  Bottom Layer w0.254: v1(7.9,16.84) 8.75,15.99 U7.38
FLASH_MOSI: length 16
  Top Layer w0.254: v1(19.18,15.95) 19.18,15.68 19.7,15.15 19.76,15.15
  Inner2 w0.254: v1(19.18,15.95) 18.67,16.46 17.54,16.46 15.89,14.81 7.25,14.81 6.74,14.3 v1(6.61,14.3)
  Bottom Layer w0.254: U7.36 7.07,14.77 v1(6.61,14.3)
GPIO0: length 9.3
  Bottom Layer w0.254: U7.23 8.75,7.73 8.3,7.28 7.29,7.28 6.65,7.91 6.65,8.93 3.48,12.1 VT2.3
GPIO4: length 12.7
  Top Layer w0.254: KEY2.1 7.95,7.5 R13.1 C29.2 7.07,8.67 ; 7.07,8.67 7.34,8.67 8.01,9.35 8.01,13.54 8.75,14.28 KEY2.2 ; 7.07,8.67 v1(7.68,8.06)
  Bottom Layer w0.254: U7.24 8.25,8.62 v1(7.68,8.06)
GPIO25: length 40
  Inner2 w0.254: v1(9.79,19.89) 8.97,19.89 7.92,18.83 5.89,18.83 5,17.95 5,16.43 5.85,15.57 5.85,12.77 6.48,12.14 7.12,12.14 9.16,10.11 11.99,10.11 v1(14.4,7.7) 16.09,6.01 17.45,6.01 17.95,5.5 17.95,4.61 16.68,3.33 v1(15.02,3.33)
  Bottom Layer w0.254: U7.14 13.25,7.86 13.41,7.7 v1(14.4,7.7) ; 16.78,2.91 16.45,2.58 15.78,2.58 v1(15.02,3.33) ; v1(9.79,19.89) 9.32,20.36 6.49,20.36 5.31,19.18
GPIO26: length 28.1
  Inner2 w0.254: 12.17,7.03 11.98,7.03 v1(11.94,6.99) ; 12.17,7.03 12.84,7.7 12.84,8.46 11.7,9.6 8.9,9.6 7.63,10.87 v1(6.87,10.87) ; 12.17,7.03 11.98,6.84 11.98,6.26 13.84,4.41 16.35,4.41 17.25,5.31 v1(17.33,5.31)
  Bottom Layer w0.254: v1(6.87,10.87) 5.85,10.87 3.82,12.91 3.82,14.56 4.71,15.44 4.71,17.32 4.56,17.47 ; U6.4 17.54,5.11 v1(17.33,5.31) ; v1(11.94,6.99) 12.09,6.99 12.78,7.68 12.78,8.67 U7.15
RTS: length 10.5
  Bottom Layer w0.254: U1.24 7.06,3.13 6.81,2.87 5.7,2.87 4.66,3.91 VT1.2 ; 4.08,4.52 4.08,6.17 3.41,6.84 3.41,8.49 2.46,9.44 R2.1
VSYS: length 15.5
  Top Layer w0.254: 8.46,19.7 U5.1 8.8,19.78 C32.1 ; 8.46,19.7 8.03,20.12 6.22,20.12 5.89,19.8 5.89,19.38 4.56,19.38 arc(4.55,19.37) 4.53,19.37 3.81,18.65 U9.B2 ; 8.46,19.7 7.89,19.13 7.89,17.6 8.39,17.1 R12.1
$1N153: length 2.7
  Bottom Layer w0.254: VT1.1 6.05,4.11 6.05,6.5
$1N154: length 1.7
  Bottom Layer w0.254: 1.22,11.15 1.22,9.57 1.26,9.53 R2.2
$1N181: length 2.1
  Bottom Layer w0.254: U1.9 13.65,4.63 14.1,5.08 R6.2
$1N233: length 5
  Bottom Layer w0.381: U7.2 19.31,14.27
$1N287: length 7.2
  Top Layer w0.254: 15.08,17.72 14.84,17.48 13.98,17.48 12.75,18.71 10.04,18.71 9.05,17.72 8.96,17.72 U5.3
$1N288: length 2.9
  Top Layer w0.254: SW?1.1 15.74,16.98 13.26,16.98 R12.2
$1N315: length 2.1
  Top Layer w0.254: R3.2 5.63,15.41 4.62,16.42 U9.D1

## Copper pours and planes (outline as drawn; the poured copper is in the pictures)
3V3 on Inner1: 22.11,11.35 22.07,12.01 21.99,12.67 21.87,13.32 21.71,13.97 21.51,14.6 21.28,15.22 21,15.83 20.7,16.41 20.35,16.98 19.98,17.53 19.57,18.05 19.13,18.55 18.66,19.01 18.16,19.46 17.64,19.86 17.09,20.24 16.52,20.58 15.94,20.89 15.33,21.17 14.71,21.4 14.08,21.6 13.43,21.76 12.78,21.88 12.12,21.96 11.46,22 10.8,22 10.13,21.96 9.47,21.88 8.82,21.76 8.18,21.6 7.54,21.4 6.92,21.17 6.32,20.89 5.73,20.58 5.16,20.24 4.62,19.86 4.09,19.46 3.6,19.01 3.13,18.55 2.69,18.05 2.28,17.53 1.9,16.98 1.56,16.41 1.25,15.83 0.98,15.22 0.74,14.6 0.54,13.97 0.39,13.32 0.27,12.67 0.19,12.01 0.15,11.35 0.15,10.68 0.19,10.02 0.27,9.36 0.39,8.71 0.54,8.07 0.74,7.43 0.98,6.81 1.25,6.21 1.56,5.62 1.9,5.05 2.28,4.51 2.69,3.98 3.13,3.49 3.6,3.02 4.09,2.58 4.62,2.17 5.16,1.79 5.73,1.45 6.32,1.14 6.92,0.87 7.54,0.63 8.18,0.43 8.82,0.28 9.47,0.16 10.13,0.08 10.8,0.04 11.46,0.04 12.12,0.08 12.78,0.16 13.43,0.28 14.08,0.43 14.71,0.63 15.33,0.87 15.94,1.14 16.52,1.45 17.09,1.79 17.64,2.17 18.16,2.58 18.66,3.02 19.13,3.49 19.57,3.98 19.98,4.51 20.35,5.05 20.7,5.62 21,6.21 21.28,6.81 21.51,7.43 21.71,8.07 21.87,8.71 21.99,9.36 22.07,10.02 22.11,10.68
3V3A on Inner1: 6.56,16.71 15.76,16.71 15.76,7.33 6.56,7.33
GND on Top Layer: 21.99,11.33 21.95,12 21.87,12.66 21.75,13.31 21.6,13.95 21.4,14.59 21.16,15.21 20.89,15.82 20.58,16.4 20.24,16.97 19.86,17.52 19.45,18.04 19.01,18.54 18.54,19.01 18.04,19.45 17.52,19.86 16.97,20.24 16.4,20.58 15.82,20.89 15.21,21.16 14.59,21.4 13.95,21.6 13.31,21.75 12.66,21.87 12,21.95 11.33,21.99 10.67,21.99 10,21.95 9.34,21.87 8.69,21.75 8.05,21.6 7.41,21.4 6.79,21.16 6.18,20.89 5.6,20.58 5.03,20.24 4.48,19.86 3.96,19.45 3.46,19.01 2.99,18.54 2.55,18.04 2.14,17.52 1.76,16.97 1.42,16.4 1.11,15.82 0.84,15.21 0.6,14.59 0.4,13.95 0.25,13.31 0.13,12.66 0.05,12 0.01,11.33 0.01,10.67 0.05,10 0.13,9.34 0.25,8.69 0.4,8.05 0.6,7.41 0.84,6.79 1.11,6.18 1.42,5.6 1.76,5.03 2.14,4.48 2.55,3.96 2.99,3.46 3.46,2.99 3.96,2.55 4.48,2.14 5.03,1.76 5.6,1.42 6.18,1.11 6.79,0.84 7.41,0.6 8.05,0.4 8.69,0.25 9.34,0.13 10,0.05 10.67,0.01 11.33,0.01 12,0.05 12.66,0.13 13.31,0.25 13.95,0.4 14.59,0.6 15.21,0.84 15.82,1.11 16.4,1.42 16.97,1.76 17.52,2.14 18.04,2.55 18.54,2.99 19.01,3.46 19.45,3.96 19.86,4.48 20.24,5.03 20.58,5.6 20.89,6.18 21.16,6.79 21.4,7.41 21.6,8.05 21.75,8.69 21.87,9.34 21.95,10 21.99,10.67
GND on Bottom Layer: 21.9,11.33 21.86,11.99 21.78,12.64 21.66,13.29 21.51,13.93 21.31,14.56 21.08,15.17 20.81,15.77 20.5,16.36 20.16,16.92 19.78,17.46 19.38,17.98 18.94,18.48 18.48,18.94 17.98,19.38 17.46,19.78 16.92,20.16 16.36,20.5 15.77,20.81 15.17,21.08 14.56,21.31 13.93,21.51 13.29,21.66 12.64,21.78 11.99,21.86 11.33,21.9 10.67,21.9 10.01,21.86 9.36,21.78 8.71,21.66 8.07,21.51 7.44,21.31 6.83,21.08 6.23,20.81 5.64,20.5 5.08,20.16 4.54,19.78 4.02,19.38 3.52,18.94 3.06,18.48 2.62,17.98 2.22,17.46 1.84,16.92 1.5,16.36 1.19,15.77 0.92,15.17 0.69,14.56 0.49,13.93 0.34,13.29 0.22,12.64 0.14,11.99 0.1,11.33 0.1,10.67 0.14,10.01 0.22,9.36 0.34,8.71 0.49,8.07 0.69,7.44 0.92,6.83 1.19,6.23 1.5,5.64 1.84,5.08 2.22,4.54 2.62,4.02 3.06,3.52 3.52,3.06 4.02,2.62 4.54,2.22 5.08,1.84 5.64,1.5 6.23,1.19 6.83,0.92 7.44,0.69 8.07,0.49 8.71,0.34 9.36,0.22 10.01,0.14 10.67,0.1 11.33,0.1 11.99,0.14 12.64,0.22 13.29,0.34 13.93,0.49 14.56,0.69 15.17,0.92 15.77,1.19 16.36,1.5 16.92,1.84 17.46,2.22 17.98,2.62 18.48,3.06 18.94,3.52 19.38,4.02 19.78,4.54 20.16,5.08 20.5,5.64 20.81,6.23 21.08,6.83 21.31,7.44 21.51,8.07 21.66,8.71 21.78,9.36 21.86,10.01 21.9,10.67
GND on Inner2: 22.38,11.21 22.34,11.87 22.26,12.53 22.14,13.18 21.98,13.83 21.78,14.46 21.54,15.08 21.27,15.69 20.96,16.28 20.62,16.85 20.24,17.39 19.83,17.92 19.39,18.41 18.92,18.88 18.42,19.32 17.9,19.73 17.35,20.11 16.78,20.45 16.2,20.76 15.59,21.04 14.97,21.27 14.33,21.47 13.69,21.63 13.04,21.75 12.38,21.83 11.71,21.87 11.05,21.87 10.39,21.83 9.73,21.75 9.07,21.63 8.43,21.47 7.79,21.27 7.17,21.04 6.57,20.76 5.98,20.45 5.41,20.11 4.86,19.73 4.34,19.32 3.84,18.88 3.37,18.41 2.93,17.92 2.52,17.39 2.14,16.85 1.8,16.28 1.49,15.69 1.22,15.08 0.98,14.46 0.79,13.83 0.63,13.18 0.51,12.53 0.43,11.87 0.39,11.21 0.39,10.54 0.43,9.88 0.51,9.22 0.63,8.56 0.79,7.92 0.98,7.28 1.22,6.66 1.49,6.06 1.8,5.47 2.14,4.9 2.52,4.35 2.93,3.83 3.37,3.33 3.84,2.86 4.34,2.42 4.86,2.01 5.41,1.64 5.98,1.29 6.57,0.98 7.17,0.71 7.79,0.47 8.43,0.28 9.07,0.12 9.73,0 10.39,-0.08 11.05,-0.12 11.71,-0.12 12.38,-0.08 13.04,0 13.69,0.12 14.33,0.28 14.97,0.47 15.59,0.71 16.2,0.98 16.78,1.29 17.35,1.64 17.9,2.01 18.42,2.42 18.92,2.86 19.39,3.33 19.83,3.83 20.24,4.35 20.62,4.9 20.96,5.47 21.27,6.06 21.54,6.66 21.78,7.28 21.98,7.92 22.14,8.56 22.26,9.22 22.34,9.88 22.38,10.54

Small or netless copper shapes (teardrops, artwork), in the pictures only: 39 on Top Layer, 78 on Bottom Layer, 5 on Inner1, 15 on Inner2

## Text on the board
Top Silkscreen Layer: VBAT | GND
